# EAGLE design db9-horizontal-autoband-R1 (EAGLE 7.6.0)
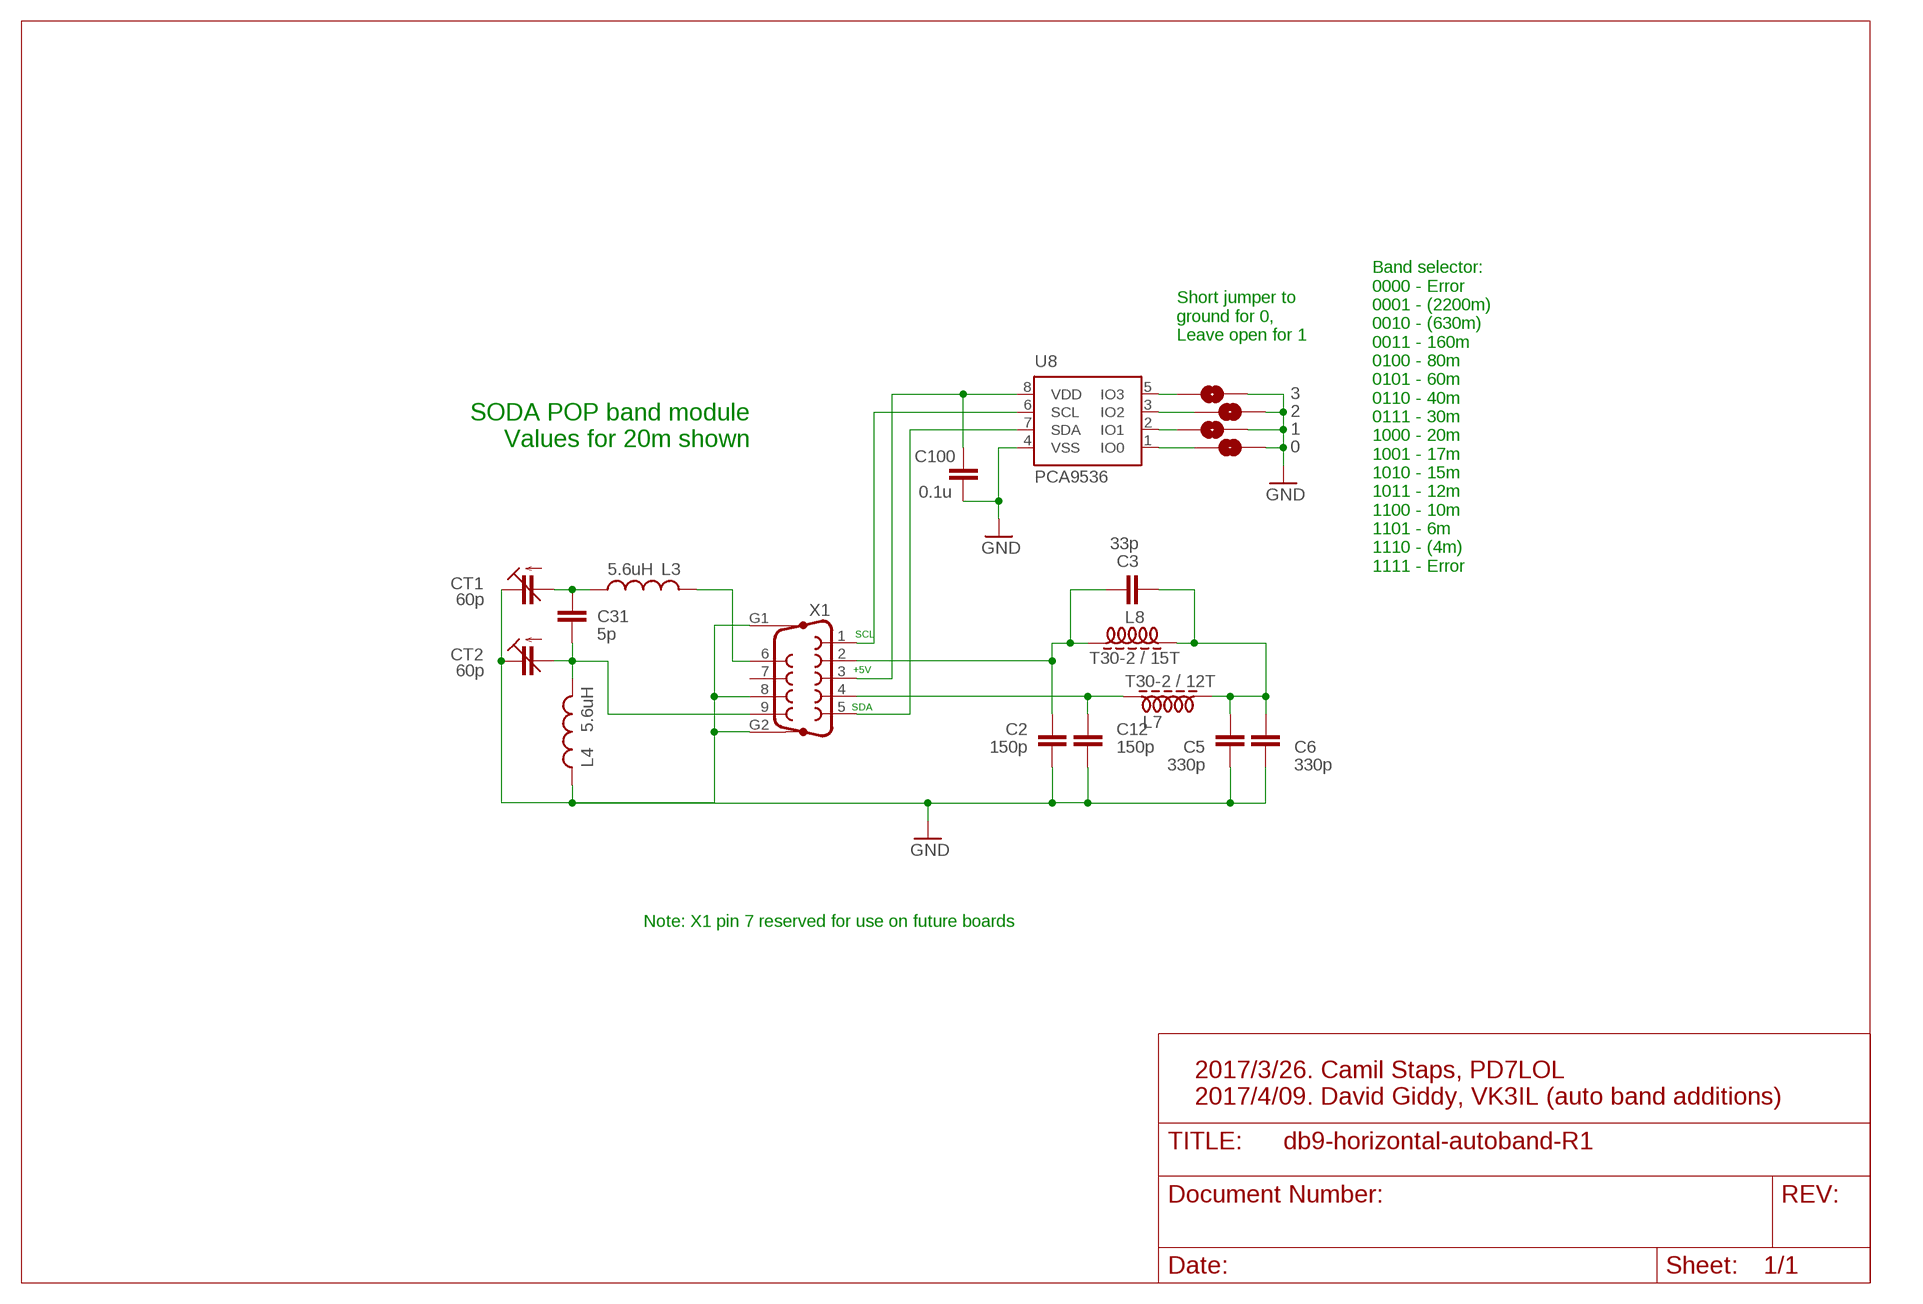
[diagram p0: schematic, sheet 1]

## Parts
0  SJ  [SJ]
1  SJ  [SJ]
2  SJ  [SJ]
3  SJ  [SJ]
C2  150p  C-EUC1206K  [C1206K]
C3  33p  C-EUC1206K  [C1206K]
C5  330p  C-EUC1206K  [C1206K]
C6  330p  C-EUC1206K  [C1206K]
C12  150p  C-EUC1206K  [C1206K]
C31  5p  C-EUC0805K  [C0805K]
C100  0.1u  C-EUC0805K  [C0805K]
CT1  60p  C-TRIMMTZ03  [CTRIMTZ03]
CT2  60p  C-TRIMMTZ03  [CTRIMTZ03]
L3  5.6uH  L-USL2012C  [L2012C]
L4  5.6uH  L-USL2012C  [L2012C]
L7  T30-2 / 12T  INDUCTORT30-2-28AWG-15T  [T30-2-28AWG-15T]
L8  T30-2 / 15T  INDUCTORT30-2-28AWG-15T  [T30-2-28AWG-15T]
U8  PCA9536  [SO8]
X1  F09VP  [F09VP]

## Nets
GND: 0.2 1.2 2.2 3.2 C2.2 C5.2 C6.2 C12.2 C100.2 CT1.1(E) CT2.1(E) L4.2 U8.4(VSS) X1.8 X1.G1 X1.G2
N$1: C31.2 CT2.2(A) L4.1 X1.9
N$2: C31.1 CT1.2(A) L3.2
N$3: L3.1 X1.6
N$4: C3.2 C5.1 C6.1 L7.P$2 L8.P$2
N$5: C12.1 L7.P$1 X1.4
N$7: C100.1 U8.8(VDD) X1.3
N$8: U8.6(SCL) X1.1
N$9: U8.7(SDA) X1.5
N$10: 3.1 U8.5(IO3)
N$11: 2.1 U8.3(IO2)
N$12: 1.1 U8.2(IO1)
N$13: 0.1 U8.1(IO0)
N$14: C2.1 C3.1 L8.P$1 X1.2
Unconnected: X1.7

## Notes on the sheet
- Short jumper to
  ground for 0,
  Leave open for 1
- SODA POP band module
  Values for 20m shown
- Band selector:
  0000 - Error
  0001 - (2200m)
  0010 - (630m)
  0011 - 160m
  0100 - 80m
  0101 - 60m
  0110 - 40m
  0111 - 30m
  1000 - 20m
  1001 - 17m
  1010 - 15m
  1011 - 12m
  1100 - 10m
  1101 - 6m
  1110 - (4m)
  1111 - Error
- SCL
- +5V
- SDA
- Note: X1 pin 7 reserved for use on future boards
- 2017/3/26. Camil Staps, PD7LOL
  2017/4/09. David Giddy, VK3IL (auto band additions)

## Library data of the parts
0 1-3 = PCA9536:SJ: SMD solder JUMPER
C2 C3 C5 C6 C12 C31 C100 = rcl:C-EU: CAPACITOR, European symbol
CT1 CT2 = PCA9536:C-TRIMM: Trimm capacitor
L3 L4 = rcl:L-US: INDUCTOR, American symbol
L7 L8 = toroids:INDUCTOR: Inductor on toroid
U8 = PCA9536:PCA9536: 4-bit I2C-bus and SMBus low power I/O port
X1 = PCA9536:F09VP: SUB-D; OC_FARNELL: unknown; OC_NEWARK: unknown

## Board
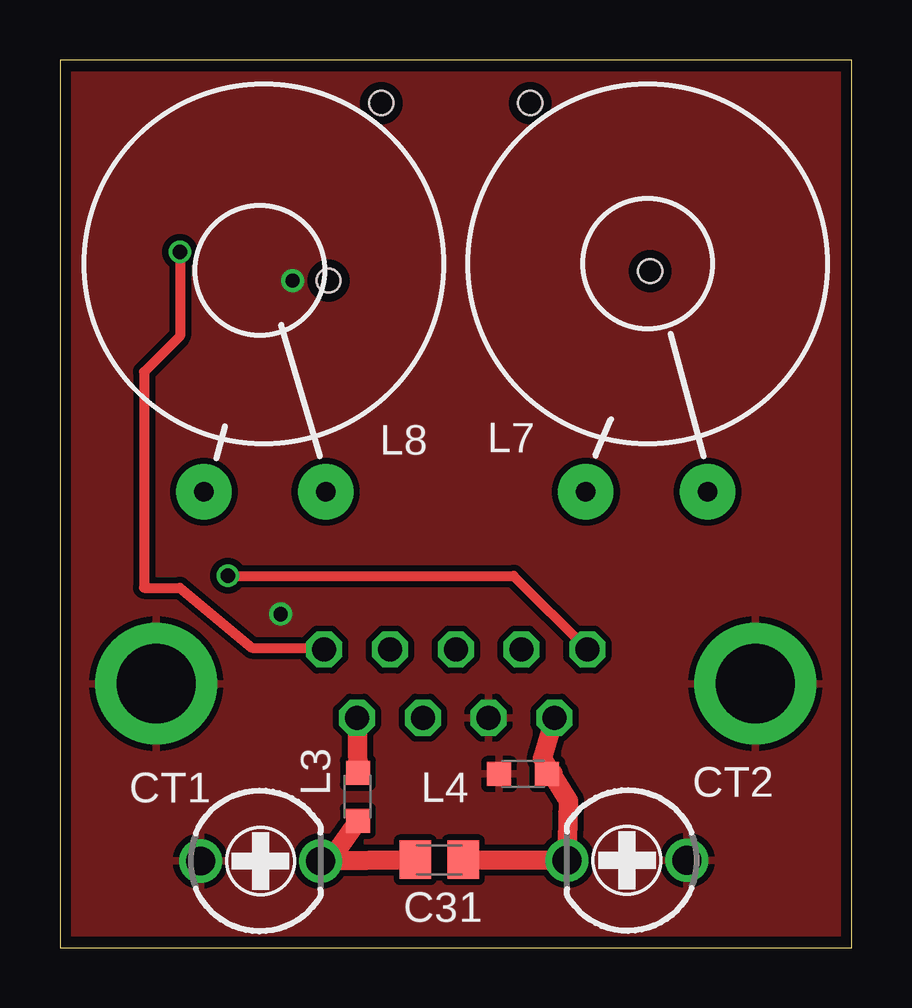
[diagram p1: board, top side]
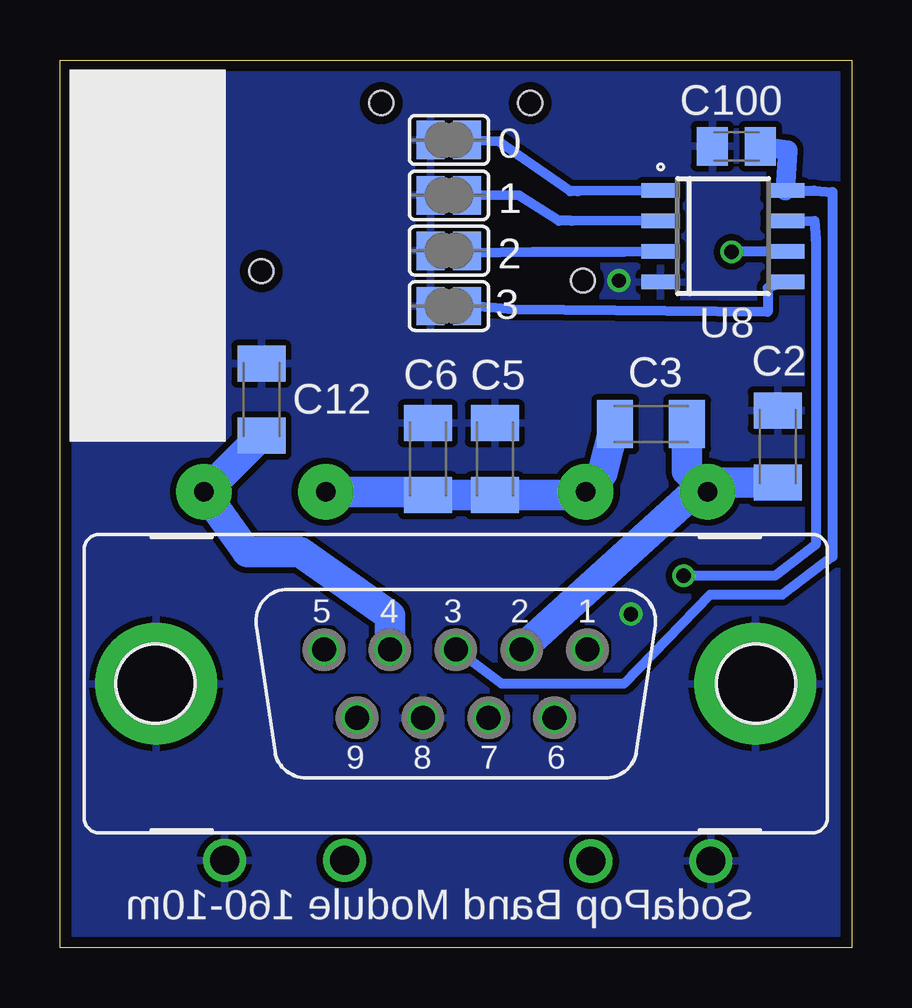
[diagram p2: board, bottom side, seen from below]

Size 33 x 37 mm. Coordinates in mm from the lower left corner, seen from the top.
Outline: 0,0 33,0 33,37 0,37 0,0
Copper layers (1*16): Top 0.0356mm / dielectric 1.5011mm / Bottom 0.0356mm
Design rules "oshpark-2layer": minimum track width 6mil, minimum drill 13mil, track to track 6mil, track to pad 6mil, pad to pad 6mil, via to via 6mil, smd to smd 6mil, copper to edge 15mil, drill to drill 6mil, minimum pad ring 7mil, minimum via ring 7mil, stop-mask expansion 2.5mil, vias tented up to drill 0mil, thermal gap 10mil
Holes 1 mm at 11.2,27.8 24.6,28.2 19.6,35.2 13.4,35.2
tRestrict: 4 lines
bRestrict: 4 lines

### Footprints (pad centres in the part's own frame; a part is rotated, then mirrored left to right if it is on the bottom)
SJ = smd 1.168 x 1.6: 1 -0.762,0; 2 0.762,0
C1206K = smd 1.5 x 2: 1 -1.5,0; 2 1.5,0
C0805K = smd 1.3 x 1.6: 1 -1,0; 2 1,0
CTRIMTZ03 = drill 1.2: 1 0,2.5; 2 0,-2.5
L2012C = smd 1 x 1: 1 -1,0; 2 1,0
T30-2-28AWG-15T = drill 0.8 pad 2.32: P$1 0,0; P$2 5.08,0
SO8 = smd 0.6 x 1.6: 1 -1.905,-2.6; 2 -0.635,-2.6; 3 0.635,-2.6; 4 1.905,-2.6; 5 1.905,2.6; 6 0.635,2.6; 7 -0.635,2.6; 8 -1.905,2.6
F09VP = drill 1 octagon: 1 5.486,1.422; 2 2.743,1.422; 3 0,1.422; 4 -2.743,1.422; 5 -5.486,1.422; 6 4.115,-1.422; 7 1.372,-1.422; 8 -1.372,-1.422; 9 -4.115,-1.422 | drill 3.3 pad 5.08: G1 -12.495,0; G2 12.495,0

### Placement (x,y rotation side)
0  16.78,33.66 180 bottom
1  16.78,31.36 180 bottom
2  16.78,29.05 180 bottom
3  16.78,26.74 180 bottom
C2  3.08,20.89 90 bottom
C3  8.36,21.81 180 bottom
C5  14.87,20.36 90 bottom
C6  17.66,20.36 90 bottom
C12  24.6,22.84 90 bottom
C31  15.81,3.66 0 top
C100  4.8,33.4 180 bottom
CT1  8.36,3.61 90 top
CT2  23.64,3.64 270 top
L3  12.42,6.29 270 top
L4  19.31,7.24 180 top
L7  27,19 180 top
L8  6,19 0 top
U8  5.36,29.66 270 bottom
X1  16.5,11 0 bottom

### Tracks (layer width: path | path; a pad name or v marks a point on that pad's centre or on a via)
GND  (via drill 0.6)
  other vias: 9.2,13.9 9.7,27.8
  pour Bottom (isolate 0.254): 0,0 0,37 33,37 33,0
  pour Top (isolate 0.254): 0,0 0,37 33.08,37 33,0
N$1
  Top 0.813: C31.2 CT2.2 21.19,6.11 20.39,7.43 | X1.9 20.11,7.88 20.39,7.43 | L4.1 20.56,7.26 20.39,7.43
N$2
  Top 0.813: C31.1 CT1.2 10.89,3.11 L3.2
N$3
  Top 0.813: L3.1 12.4,9.69 X1.6
N$4
  Bottom 1.016: 17.3,19 C6.1 | 11.02,18.86 L8.P$2
  Bottom 1.27: L7.P$2 17.3,19 | C6.1 C5.1 11.02,18.86 | L8.P$2 10.38,19.79 C3.2
N$5
  Bottom 1.016: L7.P$1 26.2,19.74
  Bottom 1.27: X1.4 19.24,13.84 23,16.5 25.2,16.5 L7.P$1 | 26.2,19.74 C12.1
N$7
  Bottom 0.406: U8.8 1.56,31.56 0.8,31.5 0.8,16.3 2.9,14.7 5.9,14.7 9.5,11 14.58,11 X1.3
  Bottom 0.813: C100.1 2.66,33.24 U8.8
N$8  (via drill 0.6)
  Top 0.406: v5,29 5,25.5 3.5,24 3.5,15 5,15 8,12.5 10.44,12.5 X1.1
  Bottom 0.406: U8.6 4.98,29.02 v5,29
N$9  (via drill 0.6)
  Top 0.406: v7,15.5 18.91,15.5 X1.5
  Bottom 0.406: U8.7 1.55,30.3 1.5,29.5 1.5,16.8 3.2,15.5 v7,15.5
N$10
  Bottom 0.406: U8.5 3.5,27.51 3.5,26.5 14.1,26.6 16.06,26.76 3.1
N$11
  Bottom 0.406: U8.3 9.48,29 13.3,29 15.95,28.95 2.1
N$12
  Bottom 0.406: U8.2 11.67,30.3 12.2,30.3 13.85,31.34 1.1
N$13
  Bottom 0.406: U8.1 11.42,31.52 11.72,31.52 14.7,33.6 0.1
N$14
  Bottom 0.813: 13.8,12.4 13.68,12.5 X1.2
  Bottom 1.016: 5.91,19.39 L8.P$1 6,19.5
  Bottom 1.27: C3.1 6.86,19.86 L8.P$1 | C2.1 5.91,19.39 | 6,19.5 13.8,12.4

### Text on the board
bNames: SodaPop Band Module 160-10m